# EAGLE design Loetstation (EAGLE 9.2.2)
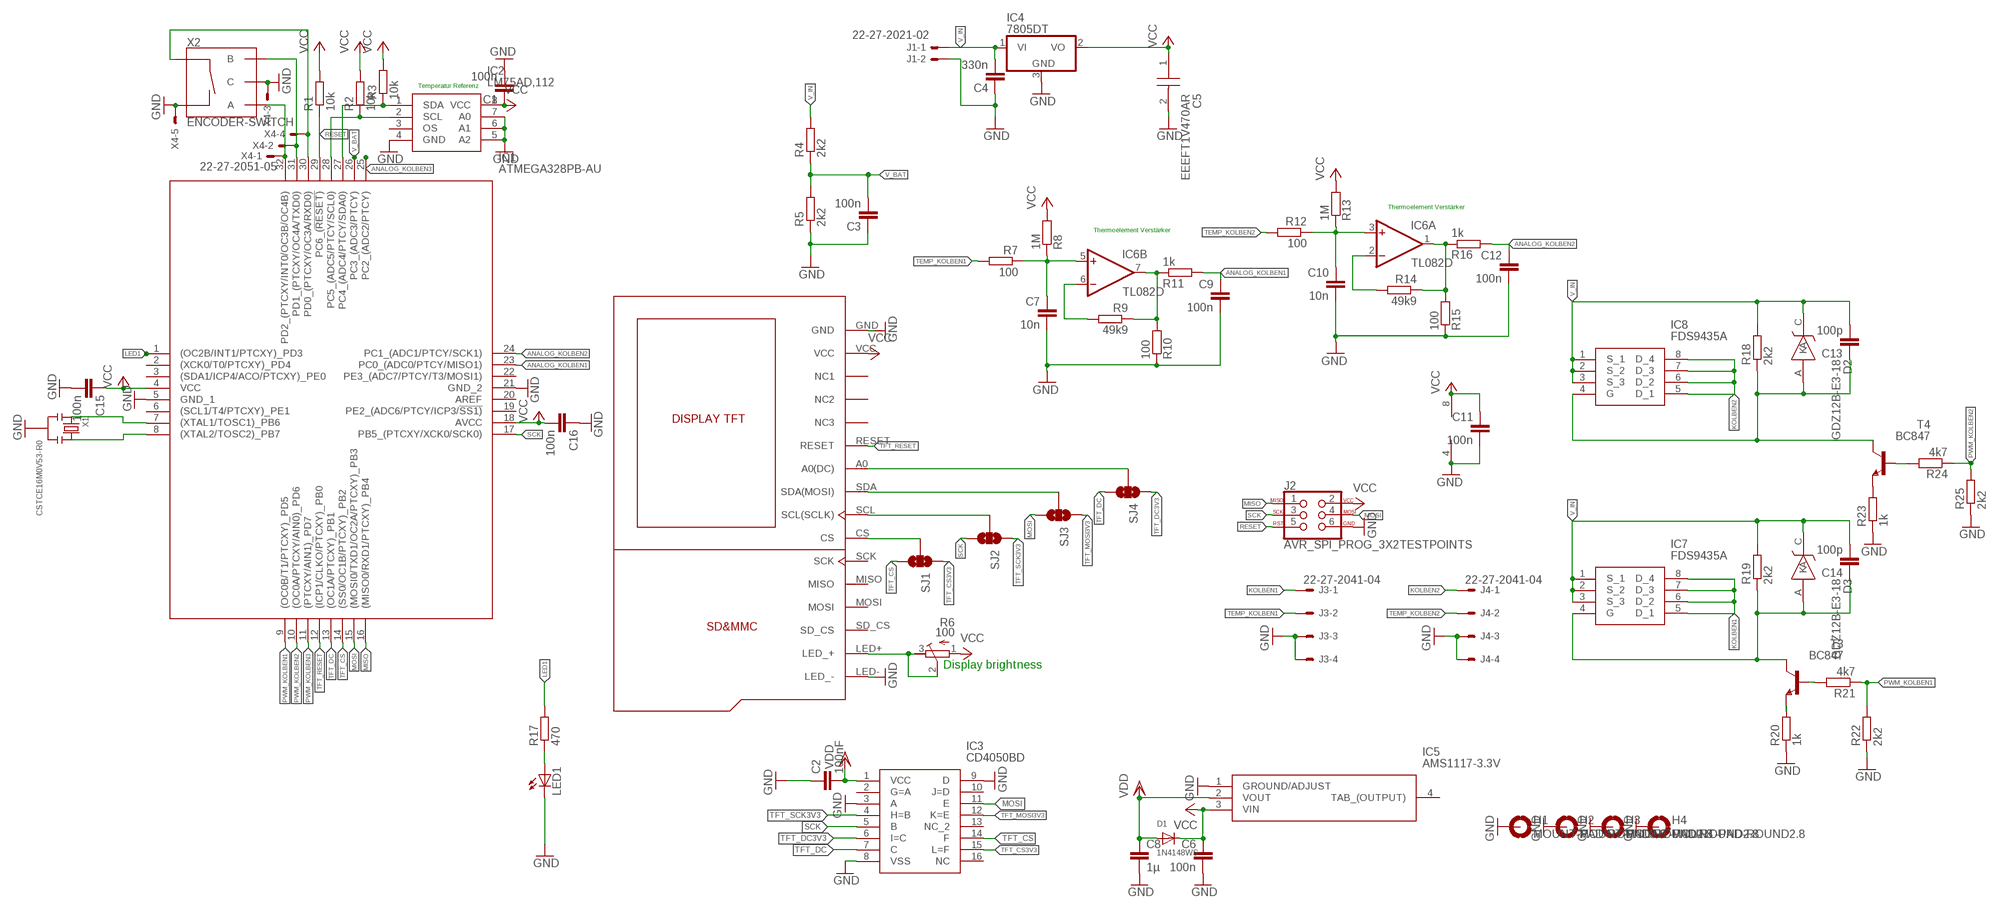
[diagram p0: schematic, sheet 1]

## Parts
C1  100n  C-EUC0603  [C0603]
C2  100nF  C-EUC0603  [C0603]
C3  100n  C-EUC0603  [C0603]
C4  330n  C-EUC0603  [C0603]
C5  EEEFT1V470AR  [EEEFT(C)]
C6  100n  C-EUC0603  [C0603]
C7  10n  C-EUC0603  [C0603]
C8  1µ  C-EUC0603  [C0603]
C9  100n  C-EUC0603  [C0603]
C10  10n  C-EUC0603  [C0603]
C11  100n  C-EUC0603  [C0603]
C12  100n  C-EUC0603  [C0603]
C13  100p  C-EUC0603  [C0603]
C14  100p  C-EUC0603  [C0603]
C15  100n  C-EUC0603  [C0603]
C16  100n  C-EUC0603  [C0603]
D1  1N4148WS  DIODESOD-323F  [SOD-323F]
D2  GDZ12B-E3-18  [SOD323-W]
D3  GDZ12B-E3-18  [SOD323-W]
H1  MOUNT-PAD-ROUND2.8  [2,8-PAD]
H2  MOUNT-PAD-ROUND2.8  [2,8-PAD]
H3  MOUNT-PAD-ROUND2.8  [2,8-PAD]
H4  MOUNT-PAD-ROUND2.8  [2,8-PAD]
IC1  ATMEGA328PB-AU  [QFP80P900X900X120-32N]
IC2  LM75AD,112  [SOIC127P600X175-8N]
IC3  CD4050BD  [SOIC127P600X175-16N]
IC4  7805DT  [TO252]
IC5  AMS1117-3.3V  [SOT229P700X180-4N]
IC6  TL082D  [SO08]
IC7  FDS9435A  [SOIC127P600X175-8N]
IC8  FDS9435A  [SOIC127P600X175-8N]
J1  22-27-2021-02  [6410-02]
J2  AVR_SPI_PROG_3X2TESTPOINTS  [2X3_TEST_POINTS]
J3  22-27-2041-04  [6410-04]
J4  22-27-2041-04  [6410-04]
LED1  LEDCHIPLED_0805  [CHIPLED_0805]
R1  10k  R-EU_R0402  [R0402]
R2  10k  R-EU_R0402  [R0402]
R3  10k  R-EU_R0402  [R0402]
R4  2k2  R-EU_R0402  [R0402]
R5  2k2  R-EU_R0402  [R0402]
R6  100  EVM-3ESX50B  [EVM-3ESX50B]
R7  100  R-EU_R0402  [R0402]
R8  1M  R-EU_R0402  [R0402]
R9  49k9  R-EU_R0402  [R0402]
R10  100  R-EU_R0402  [R0402]
R11  1k  R-EU_R0402  [R0402]
R12  100  R-EU_R0402  [R0402]
R13  1M  R-EU_R0402  [R0402]
R14  49k9  R-EU_R0402  [R0402]
R15  100  R-EU_R0402  [R0402]
R16  1k  R-EU_R0402  [R0402]
R17  470  R-EU_R0402  [R0402]
R18  2k2  R-EU_R0402  [R0402]
R19  2k2  R-EU_R0402  [R0402]
R20  1k  R-EU_R0402  [R0402]
R21  4k7  R-EU_R0402  [R0402]
R22  2k2  R-EU_R0402  [R0402]
R23  1k  R-EU_R0402  [R0402]
R24  4k7  R-EU_R0402  [R0402]
R25  2k2  R-EU_R0402  [R0402]
SJ1  SOLDERJUMPER_2WAYS  [SJ_3]
SJ2  SOLDERJUMPER_2WAYS  [SJ_3]
SJ3  SOLDERJUMPER_2WAYS  [SJ_3]
SJ4  SOLDERJUMPER_2WAYS  [SJ_3]
T3  BC847  [SOT23]
T4  BC847  [SOT23]
X1  CSTCE16M0V53-R0  [CSTCE-V]
X2  ENCODER-SWITCH  (no package)
X3  DISPLAY_TFT_1,8  [DISPLAY_TFT_1,8-KMR]
X4  22-27-2051-05  [6410-05]

## Nets
ANALOG_KOLBEN1: C9.1 IC1.23(PC0_(ADC0/PTCY/MISO1)) R11.2
ANALOG_KOLBEN2: C12.1 IC1.24(PC1_(ADC1/PTCY/SCK1)) R16.2
ANALOG_KOLBEN3: IC1.25(PC2_(ADC2/PTCY))
GND: C1.2 C2.1 C3.1 C4.1 C5.2(+) C6.2 C7.2 C8.2 C9.2 C10.2 C11.2 C12.2 C15.2 C16.1 H1.B2,8(MOUNT) H2.B2,8(MOUNT) H3.B2,8(MOUNT) H4.B2,8(MOUNT) IC1.5(GND_1) IC1.21(GND_2) IC2.4(GND) IC2.5(A2) IC2.6(A1) IC2.7(A0) IC3.3(A) IC3.8(VSS) IC3.9(D) IC4.3(GND) IC5.1(GROUND/ADJUST) IC6.4(P:V-) J1.2 J2.6 J3.3 J3.4 J4.3 J4.4 LED1.C R5.1 R10.1 R15.1 R20.1 R22.1 R23.1 R25.1 X1.2 X2.C X2.SW- X3.GND X3.LED-(LED_-) X4.3 X4.5
KOLBEN1: IC7.5(D_1) IC7.6(D_2) IC7.7(D_3) IC7.8(D_4) J3.1
KOLBEN2: IC8.5(D_1) IC8.6(D_2) IC8.7(D_3) IC8.8(D_4) J4.1
LED1: IC1.1((OC2B/INT1/PTCXY)_PD3) R17.2
MISO: IC1.16((MISO0/RXD1/PTCXY)_PB4) J2.1
MOSI: IC1.15((MOSI0/TXD1/OC2A/PTCXY)_PB3) IC3.11(E) J2.4 SJ3.3
N$1: SJ4.2 X3.A0(A0(DC))
N$2: SJ3.2 X3.SDA(SDA(MOSI))
N$4: C13.1 D2.A IC8.4(G) R18.1 T4.3(C)
N$5: C14.1 D3.A IC7.4(G) R19.1 T3.3(C)
N$6: R24.2 T4.1(B)
N$7: R23.2 T4.2(E)
N$8: IC6.7(B:OUT) R9.1 R10.2 R11.1
N$9: R21.2 T3.1(B)
N$10: R20.2 T3.2(E)
N$11: C7.1 IC6.5(B:+IN) R7.1 R8.1
N$12: IC1.7((XTAL1/TOSC1)_PB6) X1.1
N$13: IC1.8((XTAL2/TOSC2)_PB7) X1.3
N$14: IC1.28(PC5_(ADC5/PTCY/SCL0)) IC2.2(SCL) R2.1
N$15: IC1.27(PC4_(ADC4/PTCY/SDA0)) IC2.1(SDA) R3.1
N$16: SJ2.2 X3.SCL(SCL(SCLK))
N$17: SJ1.2 X3.CS
N$18: IC6.6(B:-IN) R9.2
N$19: C10.1 IC6.3(A:+IN) R12.1 R13.1
N$20: LED1.A R17.1
N$21: IC1.32(PD2_(PTCXY/INT0/OC3B/OC4B)) X2.A X4.1
N$22: IC1.31(PD1_(PTCXY/OC4A/TXD0)) X2.B X4.2
N$23: IC1.30(PD0_(PTCXY/OC3A/RXD0)) X2.SW+ X4.4
N$24: R6.2(S) R6.3(E) X3.LED+(LED_+)
N$25: IC6.1(A:OUT) R14.1 R15.2 R16.1
N$26: IC6.2(A:-IN) R14.2
PWM_KOLBEN1: IC1.9((OC0B/T1/PTCXY)_PD5) R21.1 R22.2
PWM_KOLBEN2: IC1.10((OC0A/PTCXY/AIN0)_PD6) R24.1 R25.2
PWM_KOLBEN3: IC1.11((PTCXY/AIN1)_PD7)
RESET: IC1.29(PC6_(!RESET)) J2.5 R1.1
SCK: IC1.17(PB5_(PTCXY/XCK0/SCK0)) IC3.5(B) J2.3 SJ2.3
TEMP_KOLBEN1: J3.2 R7.2
TEMP_KOLBEN2: J4.2 R12.2
TFT_CS: IC1.14((SS0/OC1B/PTCXY)_PB2) IC3.14(F) SJ1.3
TFT_CS3V3: IC3.15(L=F) SJ1.1
TFT_DC: IC1.13((OC1A/PTCXY)_PB1) IC3.7(C) SJ4.3
TFT_DC3V3: IC3.6(I=C) SJ4.1
TFT_MOSI3V3: IC3.12(K=E) SJ3.1
TFT_RESET: IC1.12((ICP1/CLKO/PTCXY)_PB0) X3.RESET
TFT_SCK3V3: IC3.4(H=B) SJ2.1
V_BAT: C3.2 IC1.26(PC3_(ADC3/PTCY)) R4.1 R5.2
V_IN: C4.2 C13.2 C14.2 D2.C(K) D3.C(K) IC4.1(VI) IC7.1(S_1) IC7.2(S_2) IC7.3(S_3) IC8.1(S_1) IC8.2(S_2) IC8.3(S_3) J1.1 R4.2 R18.2 R19.2
VCC: C1.1 C5.1(-) C6.1 C11.1 C15.1 C16.2 D1.C IC1.4(VCC) IC1.18(AVCC) IC2.8(VCC) IC4.2(VO) IC5.3(VIN) IC6.8(P:V+) J2.2 R1.2 R2.2 R3.2 R6.1(A) R8.2 R13.2 X3.VCC
VDD: C2.2 C8.1 D1.A IC3.1(VCC) IC5.2(VOUT)
Unconnected: IC1.2((XCK0/T0/PTCXY)_PD4) IC1.3((SDA1/ICP4/ACO/PTCXY)_PE0) IC1.6((SCL1/T4/PTCXY)_PE1) IC1.19(PE2_(ADC6/PTCY/ICP3/!SS1)) IC1.20(AREF) IC1.22(PE3_(ADC7/PTCY/T3/MOSI1)) IC2.3(OS) IC3.2(G=A) IC3.10(J=D) IC3.13(NC_2) IC3.16(NC) IC5.4(TAB_(OUTPUT)) X3.MISO X3.MOSI X3.NC1 X3.NC2 X3.NC3 X3.SCK X3.SD_CS

## Notes on the sheet
- Temperatur Referenz
- Thermoelement Verstärker
- Thermoelement Verstärker
- Display brightness

## Library data of the parts
C1-C4 C6-C16 = resistor:C-EU: CAPACITOR, European symbol
C5 = SamacSys_Parts:EEEFT1V470AR: FT SMT Al elec capacitor 47uF 35V Panasonic 47F 35 V dc Aluminium Electrolytic Capacitor C, FT SMD Series 2000h 5 Dia. x 5.8mm Source: Datasheet <http://uk.rs-online.com/web/p/products/1034782>; ALLIED_NUMBER: 70256704; ALLIED_PRICE/STOCK: https://www.alliedelec.com/panasonic-eee-ft1v470ar/70256704/; ARROW_PART_NUMBER: EEEFT1V470AR; ARROW_PRICE/STOCK: https://www.arrow.com/en/products/eeeft1v470ar/panasonic; DESCRIPTION: FT SMT Al elec capacitor 47uF 35V Panasonic 47F 35 V dc Aluminium Electrolytic Capacitor C, FT SMD Series 2000h 5 Dia. x 5.8mm; HEIGHT: mm; MANUFACTURER_NAME: Panasonic; MANUFACTURER_PART_NUMBER: EEEFT1V470AR; RS_PART_NUMBER: 7296261P; RS_PRICE/STOCK: http://uk.rs-online.com/web/p/products/7296261P
D1 = adafruit:DIODE: Diode SMADIODE - SMA Surface Mount Package 20V 1A Schottky Diode Digikey: 641-1014-6-ND DO-1N4148 - Through Hole Small Current Diode SOD-123 20V 1 A (.5mV Vf) Schottky Diode - Digikey: MBRX120TPMSCT-ND SOD-323 10V 570mA (.38mV Vf, 3ns) Schottky Diode - Digikey: ZLLS410CT-ND SOD-523 30V 30mA Schottky Diode (RB751S-40TE61) - Digikey: RB751S-40TE61CT-ND SOT23-R/W - SOT23 Package (R = Solder Paste/Reflow Ovens, W = Hand-Soldering) BAT54Film 40V 300mA - Digikey: 497-7162-1-ND
D2 D3 = user:GDZ12B-E3-18: Zener Diodes 12 Volt 0.2 Watt 2% Source: Datasheet <https://componentsearchengine.com/Datasheets/1/GDZ12B-E3-18.pdf>; SPICEPREFIX: D
H1-H4 = holes:MOUNT-PAD-ROUND: MOUNTING PAD, round
IC1 = SamacSys_Parts:ATMEGA328PB-AU: ATMEL - ATMEGA328PB-AU - MCU, 8BIT, ATMEGA, 20MHZ, TQFP-32 Source: Datasheet <http://www.farnell.com/datasheets/2014286.pdf>; ARROW_PART_NUMBER: ATMEGA328PB-AU; ARROW_PRICE/STOCK: https://www.arrow.com/en/products/atmega328pb-au/microchip-technology; DESCRIPTION: ATMEL - ATMEGA328PB-AU - MCU, 8BIT, ATMEGA, 20MHZ, TQFP-32; HEIGHT: 1.2mm; MANUFACTURER_NAME: Microchip; MANUFACTURER_PART_NUMBER: ATMEGA328PB-AU; RS_PART_NUMBER: 1463221; RS_PRICE/STOCK: http://uk.rs-online.com/web/p/products/1463221
IC2 = SamacSys_Parts:LM75AD,112: LM75AD,112, 11bit Temperature Sensor 3C Serial-I2C 2.8 to 5.5V 8-Pin SOIC Source: Datasheet <http://docs-europe.electrocomponents.com/webdocs/0b4c/0900766b80b4c8ed.pdf>; ARROW_PART_NUMBER: LM75AD,112; ARROW_PRICE-STOCK: https://www.arrow.com/en/products/lm75ad112/nxp-semiconductors; DESCRIPTION: LM75AD,112, 11bit Temperature Sensor 3C Serial-I2C 2.8 to 5.5V 8-Pin SOIC; HEIGHT: 1.75mm; MANUFACTURER_NAME: Nexperia; MANUFACTURER_PART_NUMBER: LM75AD,112; RS_PART_NUMBER: 1242317; RS_PRICE-STOCK: http://uk.rs-online.com/web/p/products/1242317
IC3 = SamacSys_Parts:CD4050BD: CMOS Hex Non-Inverting Buffer/Converter Source: Datasheet <http://www.ti.com/lit/gpn/cd4050b>; ARROW_PART_NUMBER: CD4050BD; ARROW_PRICE-STOCK: https://www.arrow.com/en/products/cd4050bd/texas-instruments; DESCRIPTION: CMOS Hex Non-Inverting Buffer/Converter; HEIGHT: mm; MANUFACTURER_NAME: Texas Instruments; MANUFACTURER_PART_NUMBER: CD4050BD; RS_PART_NUMBER: 8072365; RS_PRICE-STOCK: http://uk.rs-online.com/web/p/products/8072365
IC4 = linear:78*: Positive VOLTAGE REGULATOR Source: http://cache.national.com/ds/LM/LM78L05.pdf http://www.fairchildsemi.com/ds/LM/LM7805.pdf
IC5 = SamacSys_Parts:AMS1117-3.3V: 1A LOW DROPOUT VOLTAGE REGULATOR, SOT-223 Source: Datasheet <http://www.advanced-monolithic.com/pdf/ds1117.pdf>; ARROW_PART_NUMBER: ams1117-3.3v; DESCRIPTION: 1A LOW DROPOUT VOLTAGE REGULATOR, SOT-223; HEIGHT: 1.8mm; MANUFACTURER_NAME: Advanced Monolithic Systems; MANUFACTURER_PART_NUMBER: ams1117-3.3v
IC6 = linear:TL082: OP AMP Data sheet <http://www.ti.com/lit/ds/symlink/tl084a . pdf>; DATA_SHEET: <a href="http://www.ti.com/lit/ds/symlink/tl084a.pdf"> Data sheet </a>; SPICEPREFIX: J
IC7 IC8 = SamacSys_Parts:FDS9435A: FDS9435A, P-channel MOSFET Transistor 5.3 A 30 V, 8-Pin SOIC Source: Datasheet <http://docs-emea.rs-online.com/webdocs/0d23/0900766b80d237a1.pdf>; DESCRIPTION: FDS9435A, P-channel MOSFET Transistor 5.3 A 30 V, 8-Pin SOIC; HEIGHT: 1.75mm; MANUFACTURER_NAME: Fairchild Semiconductor; MANUFACTURER_PART_NUMBER: FDS9435A; MOUSER_PART_NUMBER: 512-FDS9435A; MOUSER_PRICE-STOCK: https://www.mouser.com/Search/Refine.aspx?Keyword=512-FDS9435A; RS_PART_NUMBER: 6710750P; RS_PRICE-STOCK: http://uk.rs-online.com/web/p/products/6710750P
J1 = con-molex:22-?-02: CONNECTOR wire to board 2.54 mm (.1 inch) pitch header; MF: MOLEX; OC_FARNELL: unknown; OC_NEWARK: unknown
J2 = SparkFun-Connectors:AVR_SPI_PROG_3X2: AVR ISP 6 Pin This is the reduced ISP connector for AVR programming. Common on Arduino. This footprint will take up less PCB space and can be used with a 10-pin to 6-pin adapter such as SKU: BOB-08508 **Special note about "TEST_POINT" package. The stop mask is on the top side, so if you want your programming test points to be on the bottom of your board, make sure to place this package on the bottom side of the board. This also ensure that the orientation to program from the bottom side will be correct. SparkFun Products: SparkFun ISP Pogo Adapter <https://www.sparkfun.com/products/11591> - NS Tiny AVR Programmer <https://www.sparkfun.com/products/11801> -PTH
J3 J4 = con-molex:22-?-04: CONNECTOR wire to board 2.54 mm (.1 inch) pitch header; MF: MOLEX; OC_FARNELL: unknown; OC_NEWARK: unknown
LED1 = led:LED: LED OSRAM: - CHIPLED LG R971, LG N971, LY N971, LG Q971, LY Q971, LO R971, LY R971 LH N974, LH R974 LS Q976, LO Q976, LY Q976 LO Q996 - Hyper CHIPLED LW Q18S LB Q993, LB Q99A, LB R99A - SideLED LS A670, LO A670, LY A670, LG A670, LP A670 LB A673, LV A673, LT A673, LW A673 LH A674 LY A675 LS A676, LA A676, LO A676, LY A676, LW A676 LS A679, LY A679, LG A679 - Hyper Micro SIDELED® LS Y876, LA Y876, LO Y876, LY Y876 LT Y87S - SmartLED LW L88C, LW L88S LB L89C, LB L89S, LG L890 LS L89K, LO L89K, LY L89K LS L896, LA L896, LO L896, LY L896 - TOPLED LS T670, LO T670, LY T670, LG T670, LP T670 LSG T670, LSP T670, LSY T670, LOP T670, LYG T670 LG T671, LOG T671, LSG T671 LB T673, LV T673, LT T673, LW T673 LH T674 LS T676, LA T676, LO T676, LY T676, LB T676, LH T676, LSB T676, LW T676 LB T67C, LV T67C, LT T67C, LS T67K, LO T67K, LY T67K, LW E67C LS E67B, LA E67B, LO E67B, LY E67B, LB E67C, LV E67C, LT E67C LW T67C LS T679, LY T679, LG T679 LS T770, LO T770, LY T770, LG T770, LP T770 LB T773, LV T773, LT T773, LW T773 LH T774 LS E675, LA E675, LY E675, LS T675 LS T776, LA T776, LO T776, LY T776, LB T776 LHGB T686 LT T68C, LB T68C - Hyper Mini TOPLED® LB M676 - Mini TOPLED Santana® LG M470 LS M47K, LO M47K, LY M47K Source: http://www.osram.convergy.de LUXEON: - LUMILED® LXK2-PW12-R00, LXK2-PW12-S00, LXK2-PW14-U00, LXK2-PW14-V00 LXK2-PM12-R00, LXK2-PM12-S00, LXK2-PM14-U00 LXK2-PE12-Q00, LXK2-PE12-R00, LXK2-PE12-S00, LXK2-PE14-T00, LXK2-PE14-U00 LXK2-PB12-K00, LXK2-PB12-L00, LXK2-PB12-M00, LXK2-PB14-N00, LXK2-PB14-P00, LXK2-PB14-Q00 LXK2-PR12-L00, LXK2-PR12-M00, LXK2-PR14-Q00, LXK2-PR14-R00 LXK2-PD12-Q00, LXK2-PD12-R00, LXK2-PD12-S00 LXK2-PH12-R00, LXK2-PH12-S00 LXK2-PL12-P00, LXK2-PL12-Q00, LXK2-PL12-R00 Source: www.luxeon.com KINGBRIGHT: KA-3528ASYC Source: www.kingbright.com
R1-R5 R7-R25 = resistor:R-EU_: RESISTOR, European symbol
R6 = user:EVM-3ESX50B
SJ1-SJ4 = SparkFun-Retired:SOLDERJUMPER_2WAY: Solder Jumper 2 way solder jumper
T3 T4 = transistor:BC847: NPN TRANSISTOR
X1 = user:CSTCE16M0V53-R0: Ceramic resonator SMT CSTCE 16.00MHz CSTCE16M0V53-R0, Ceramic Resonator, 16MHz Expander 15pF, 3-Pin Cap Chip, 3.2 x 1.3 x 0.9mm Source: Datasheet <http://uk.rs-online.com/web/p/products/6241077>; ARROW_PART_NUMBER: CSTCE16M0V53-R0; ARROW_PRICE-STOCK: https://www.arrow.com/en/products/cstce16m0v53-r0/murata-manufacturing; DESCRIPTION: Ceramic resonator SMT CSTCE 16.00MHz CSTCE16M0V53-R0, Ceramic Resonator, 16MHz Expander 15pF, 3-Pin Cap Chip, 3.2 x 1.3 x 0.9mm; HEIGHT: mm; MANUFACTURER_NAME: Murata Electronics; MANUFACTURER_PART_NUMBER: CSTCE16M0V53-R0; RS_PART_NUMBER: 7926524P; RS_PRICE-STOCK: http://uk.rs-online.com/web/p/products/7926524P
X2 = Symbols-Not-On-Board:ENCODER-SWITCH
X3 = display-TFT-1.8-KMR:DISPLAY_TFT_1,8
X4 = con-molex:22-?-05: CONNECTOR wire to board 2.54 mm (.1 inch) pitch header; MF: MOLEX; OC_FARNELL: unknown; OC_NEWARK: unknown

## Net classes
0 default: width 0.089 mm, drill 0.3 mm

## Board
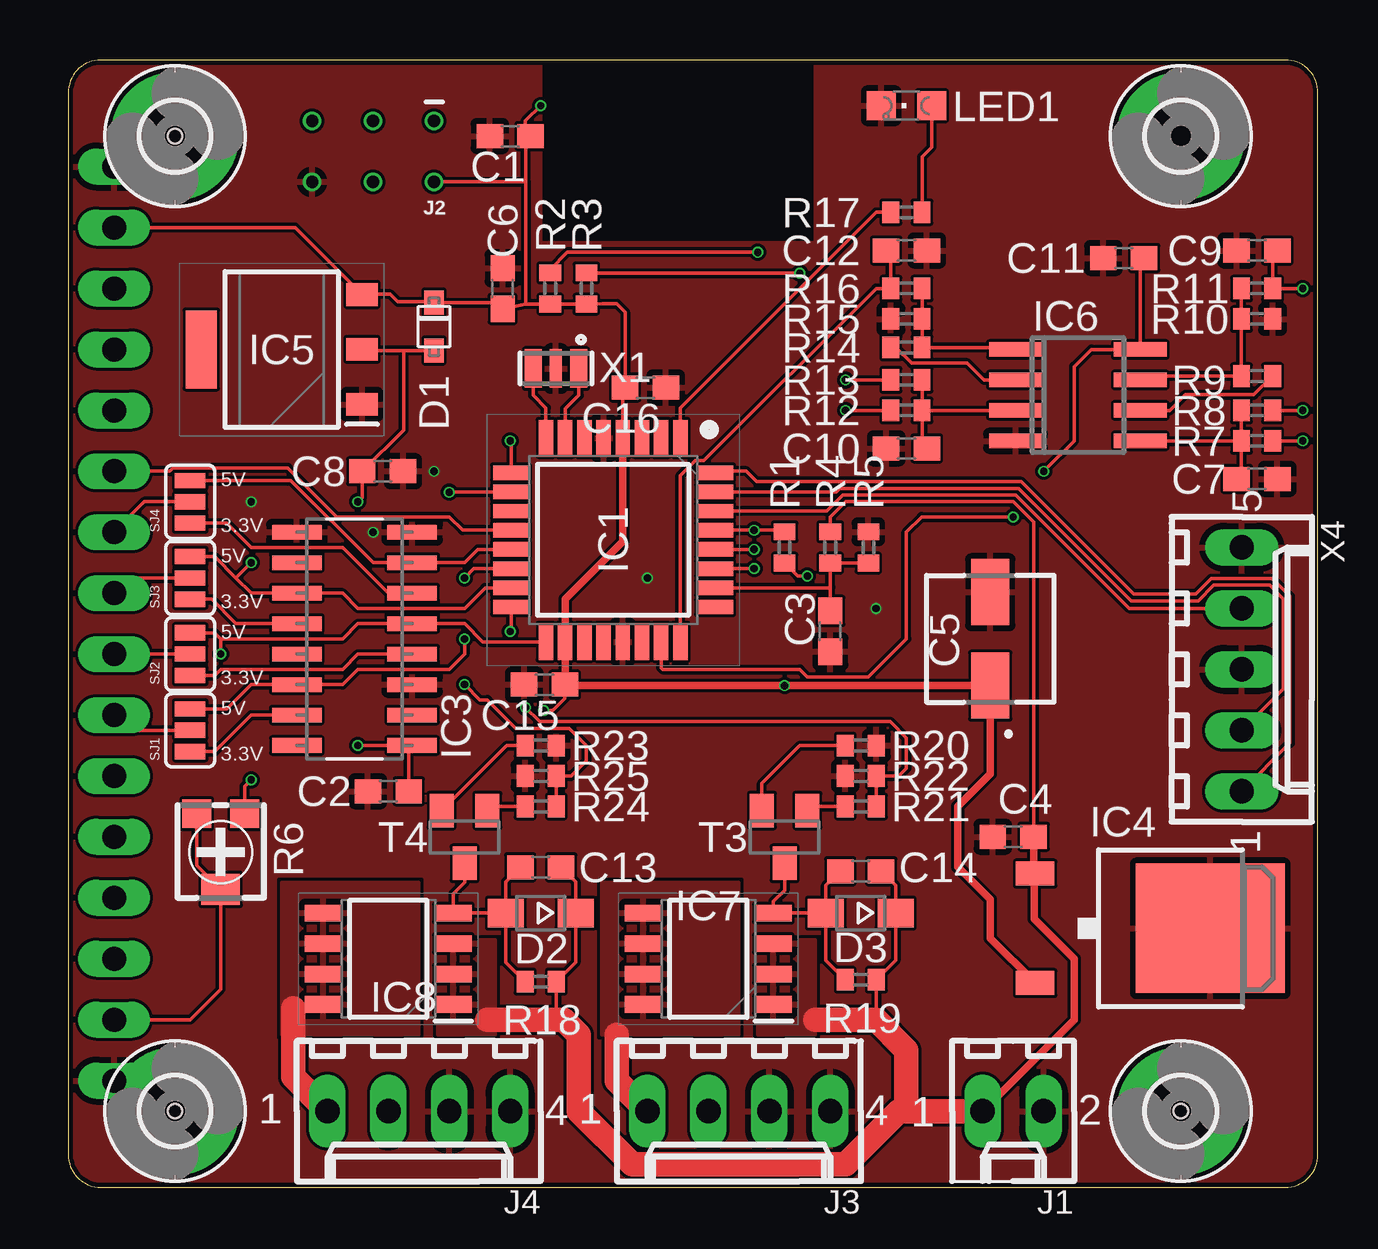
[diagram p1: board, top side]
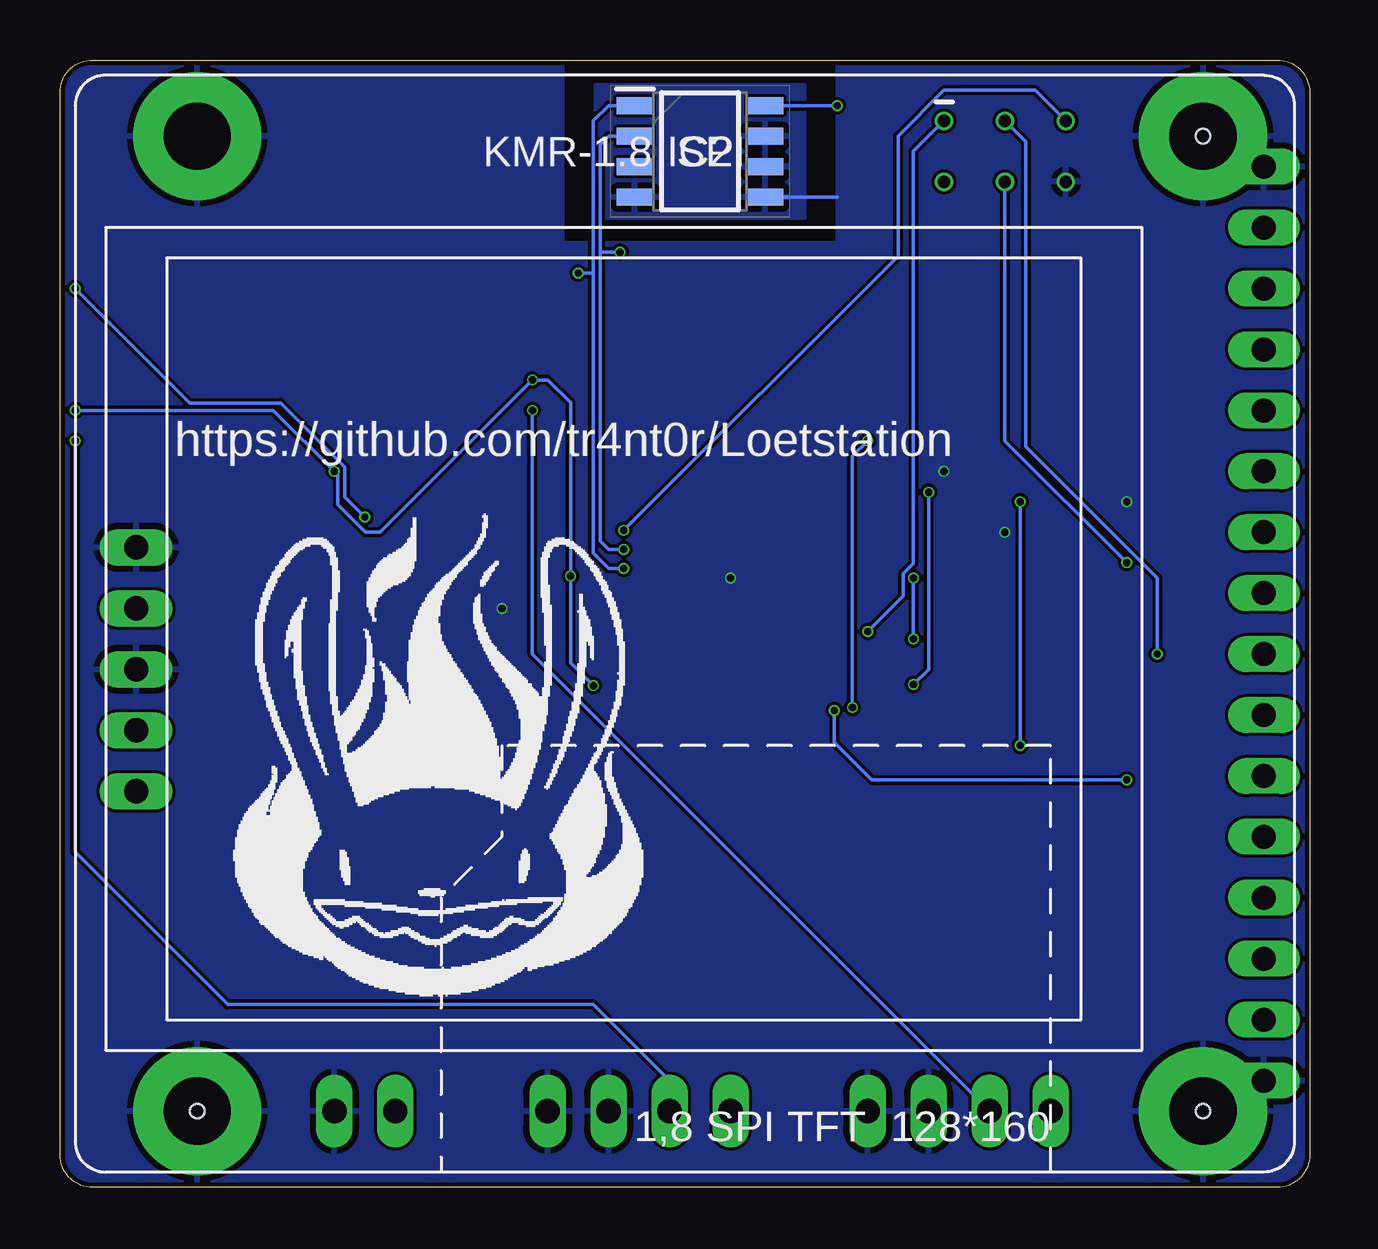
[diagram p2: board, bottom side, seen from below]

Size 52.07 x 46.99 mm. Coordinates in mm from the lower left corner, seen from the top.
Outline: 1.34,0 50.72,0 arc90 52.07,1.35 52.07,45.63 arc90 50.72,46.99 1.35,46.99 arc90 0,45.63 0,1.34 arc90 1.34,0
Copper layers (1*16): Top 0.035mm / dielectric 1.5mm / Bottom 0.035mm
Design rules "jlcpcb *": minimum track width 3.5mil, minimum drill 0.3mm, track to track 5mil, track to pad 5mil, pad to pad 6mil, via to via 6mil, smd to smd 6mil, copper to edge 0.2mm, drill to drill 0.3mm, minimum pad ring 3mil, minimum via ring 3mil, stop-mask expansion 4mil, vias tented up to drill 0mil, thermal gap 10mil

### Footprints (pad centres in the part's own frame; a part is rotated, then mirrored left to right if it is on the bottom)
C0603 = smd 1.1 x 1: 1 -0.85,0; 2 0.85,0
EEEFT(C) = smd 2.75 x 1.6: 1 -1.95,0; 2 1.95,0
SOD-323F = smd 1 x 0.8: A -1,0; C 1,0
SOD323-W = smd 1.5 x 1.2: A 1.45,0; C -1.45,0
2,8-PAD = drill 2.8 pad 5.334: B2,8 0,0
QFP80P900X900X120-32N = smd 1.5 x 0.6: 1 -4.25,2.8; 2 -4.25,2; 3 -4.25,1.2; 4 -4.25,0.4; 5 -4.25,-0.4; 6 -4.25,-1.2; 7 -4.25,-2; 8 -4.25,-2.8; 17 4.25,-2.8; 18 4.25,-2; 19 4.25,-1.2; 20 4.25,-0.4; 21 4.25,0.4; 22 4.25,1.2; 23 4.25,2; 24 4.25,2.8 | smd 0.6 x 1.5: 9 -2.8,-4.25; 10 -2,-4.25; 11 -1.2,-4.25; 12 -0.4,-4.25; 13 0.4,-4.25; 14 1.2,-4.25; 15 2,-4.25; 16 2.8,-4.25; 25 2.8,4.25; 26 2,4.25; 27 1.2,4.25; 28 0.4,4.25; 29 -0.4,4.25; 30 -1.2,4.25; 31 -2,4.25; 32 -2.8,4.25
SOIC127P600X175-8N = smd 1.525 x 0.7: 1 -2.712,1.905; 2 -2.712,0.635; 3 -2.712,-0.635; 4 -2.712,-1.905; 5 2.712,-1.905; 6 2.712,-0.635; 7 2.712,0.635; 8 2.712,1.905
SOIC127P600X175-16N = smd 2.057 x 0.61: 1 -4.801,8.89; 2 -4.801,7.62; 3 -4.801,6.35; 4 -4.801,5.08; 5 -4.801,3.81; 6 -4.801,2.54; 7 -4.801,1.27; 8 -4.801,0; 9 0,0; 10 0,1.27; 11 0,2.54; 12 0,3.81; 13 0,5.08; 14 0,6.35; 15 0,7.62; 16 0,8.89
TO252 = smd 1 x 1.6: 1 -2.28,-4.8; 2 2.28,-4.8 | smd 5.4 x 6.2: 3 0,2.5
SOT229P700X180-4N = smd 1.3 x 0.95: 1 -3.35,2.29; 2 -3.35,0; 3 -3.35,-2.29 | smd 1.3 x 3.25: 4 3.35,0
SO08 = smd 0.6 x 2.2: 1 -1.905,-2.6; 2 -0.635,-2.6; 3 0.635,-2.6; 4 1.905,-2.6; 5 1.905,2.6; 6 0.635,2.6; 7 -0.635,2.6; 8 -1.905,2.6
6410-02 = drill 1.016 long: 1 1.27,0; 2 -1.27,0
2X3_TEST_POINTS = drill 0.508: 1 -2.54,-1.27; 2 -2.54,1.27; 3 0,-1.27; 4 0,1.27; 5 2.54,-1.27; 6 2.54,1.27
6410-04 = drill 1.016 long: 1 3.81,0; 2 1.27,0; 3 -1.27,0; 4 -3.81,0
CHIPLED_0805 = smd 1.2 x 1.2: A 0,-1.05; C 0,1.05
R0402 = smd 0.7 x 0.9: 1 -0.65,0; 2 0.65,0
EVM-3ESX50B = smd 1.2 x 1.2: 1 -1,-1.6; 3 1,-1.6 | smd 1.6 x 1.3: 2 0,1.55
SJ_3 = smd 0.635 x 1.27: 1 -0.889,0; 2 0,0; 3 0.889,0
SOT23 = smd 1 x 1.4: 1 -0.95,-1.1; 2 0.95,-1.1; 3 0,1.1
CSTCE-V = smd 0.7 x 1.6: 1 0.95,0; 3 -0.95,0 | smd 0.5 x 1.6: 2 0,0
DISPLAY_TFT_1,8-KMR = drill 1 long: A0 -25.4,-3.81; CS -25.4,3.81; GND -25.4,-19.05; LED+ -25.4,16.51; LED- -25.4,19.05; MISO -25.4,8.89; MOSI -25.4,11.43; NC1 -25.4,-13.97; NC2 -25.4,-11.43; NC3 -25.4,-8.89; RESET -25.4,-6.35; SCK -25.4,6.35; SCL -25.4,1.27; SD_CS -25.4,13.97; SDA -25.4,-1.27; VCC -25.4,-16.51 | hole 0.6: -22.86,-20.32; -22.86,20.32; 19.05,20.32
6410-05 = drill 1.016 long: 1 5.08,0; 2 2.54,0; 3 0,0; 4 -2.54,0; 5 -5.08,0

### Placement (x,y rotation side)
C1  18.41,43.81 180 top
C2  13.34,16.51 0 top
C3  31.75,23.18 90 top
C4  39.37,14.61 0 top
C5  38.42,22.86 90 top
C6  18.1,37.47 90 top
C7  49.53,29.53 0 top
C8  13.1,29.84 0 top
C9  49.53,39.05 180 top
C10  34.92,30.8 180 top
C11  43.97,38.73 180 top
C12  34.92,39.05 0 top
C13  19.68,13.34 0 top
C14  33.02,13.18 0 top
C15  19.84,20.95 180 top
C16  24.05,33.34 180 top
D1  15.24,35.88 90 top
D2  19.68,11.43 180 top
D3  33.02,11.43 180 top
H1  46.35,3.17 0 top
H2  4.45,3.17 0 top
H3  4.45,43.81 0 top
H4  46.35,43.81 0 top
IC1  22.7,26.99 270 top
IC2  25.4,43.18 0 bottom
IC3  9.53,27.3 180 top
IC4  45.09,10.79 270 top
IC5  8.89,34.92 180 top
IC6  42.07,33.02 270 top
IC7  26.67,9.53 180 top
IC8  13.34,9.53 180 top
J1  39.37,3.17 180 top
J2  12.7,43.18 180 top
J3  27.94,3.17 180 top
J4  14.61,3.17 180 top
LED1  34.92,45.09 90 top
R1  29.84,26.67 270 top
R2  20.08,37.47 270 top
R3  21.59,37.47 270 top
R4  31.75,26.67 90 top
R5  33.34,26.67 270 top
R6  6.35,13.97 180 top
R7  49.53,31.11 0 top
R8  49.53,32.38 0 top
R9  49.53,33.81 0 top
R10  49.53,36.2 180 top
R11  49.53,37.47 0 top
R12  34.92,32.38 180 top
R13  34.92,33.66 180 top
R14  34.92,35 180 top
R15  34.92,36.2 0 top
R16  34.92,37.47 180 top
R17  34.92,40.64 180 top
R18  19.68,8.57 0 top
R19  33.02,8.65 0 top
R20  33.02,18.41 180 top
R21  33.02,15.88 180 top
R22  33.02,17.14 0 top
R23  19.68,18.41 180 top
R24  19.68,15.88 180 top
R25  19.68,17.14 0 top
SJ1  5.08,19.05 90 top
SJ2  5.08,22.23 90 top
SJ3  5.08,25.4 90 top
SJ4  5.08,28.57 90 top
T3  29.84,14.61 180 top
T4  16.51,14.61 180 top
X1  20.32,34.13 0 top
X3  27.3,23.5 180 bottom
X4  48.9,21.59 270 top

### Tracks (layer width: path | path; a pad name or v marks a point on that pad's centre or on a via)
ANALOG_KOLBEN1  (via drill 0.3)
  Top 0.152: IC1.23 24.7,21.65 24.77,21.59 30.48,21.59 30.8,21.27 33.34,21.27 34.92,22.86 34.92,27.3 35.56,27.94 v39.37,27.94 | v51.44,37.47 R11.2 50.18,38.53 C9.1
  Bottom 0.152: v39.37,27.94 40.21,28.78 40.21,30.02 42.88,32.69 46.66,32.69 v51.44,37.47
ANALOG_KOLBEN2
  Top 0.152: IC1.24 25.5,29.68 26.12,30.29 26.48,30.29 33.66,37.47 R16.2 34.27,38.53 C12.1
GND  (via drill 0.3)
  Bottom 0.152: IC2.5 19.68,41.27
  other vias: 24.13,25.4 12.7,27.3 7.62,28.57 15.24,29.84 33.66,24.13
  pour Bottom: 21.03,45.96 21.03,40.4 29.77,40.4 29.77,45.96
  pour Bottom (rank 2): 19.68,46.99 1.34,46.99 arc90 0,45.65 0,1.36 arc90 1.36,0 50.71,0 arc90 52.07,1.36 52.07,45.63 arc90 50.71,46.99 31.11,46.99 31.11,39.37 19.68,39.37
  pour Bottom (no thermals): 40.64,10.16 46.99,10.16 46.99,17.14 40.64,17.14
  pour Top (rank 2): 1.36,0 50.73,0 arc90 52.07,1.34 52.07,45.63 arc90 50.71,46.99 31.11,46.99 31.11,39.37 19.68,39.37 19.68,46.92 19.76,46.99 1.34,46.99 arc90 0,45.65 0,1.36 arc90
KOLBEN1
  Top 1.016: J3.1 22.86,4.45 22.86,6.35
  pour Top: 27.94,6.35 22.23,6.35 22.23,12.7 27.94,12.7
KOLBEN2
  Top 1.016: J4.1 9.37,4.6 9.37,7.46
  pour Top: 14.61,6.35 8.89,6.35 8.89,12.7 14.61,12.7
LED1
  Top 0.152: IC1.1 25.5,32.49 33.66,40.64 R17.2
MISO  (via drill 0.3)
  Top 0.152: v18.41,23.17 18.45,23.2 IC1.16
  Bottom 0.152: J2.1 16.51,43.18 16.51,26.01 16.94,25.58 16.94,24.64 v18.41,23.17
MOSI  (via drill 0.3)
  Top 0.152: SJ3.3 6.1,26.29 6.99,25.4 | 6.99,25.4 7.62,24.77 IC3.11 11.43,24.77 12.06,24.13 16.51,24.13 17.37,24.99 IC1.15 | v7.62,26.04 6.99,25.4
  Bottom 0.152: J2.4 12.7,31.11 v7.62,26.04
N$1
  Top 0.152: SJ4.2 3.17,28.57 X3.A0
N$2
  Top 0.152: X3.SDA 2.54,25.4 SJ3.2
N$4
  Top 0.152: T4.3 16.51,12.7 16.05,12.24 IC8.4 D2.A | D2.A 18.23,9.37 R18.1 | C13.1 18.23,12.73 D2.A
N$5
  Top 0.152: D3.A 31.57,12.58 C14.1 | D3.A 31.57,9.45 R19.1 | T3.3 29.84,12.38 29.38,11.92 IC7.4 D3.A
N$6
  Top 0.152: T4.1 17.63,15.88 R24.2
N$7
  Top 0.152: T4.2 18.27,18.41 R23.2
N$8
  Top 0.152: R10.2 48.9,36.2 R10.2 | R10.2 R9.1 44.83,33.81 IC6.7 | R10.2 R11.1
N$9
  Top 0.152: T3.1 30.96,15.88 R21.2
N$10
  Top 0.152: T3.2 28.89,16.83 30.48,18.41 R20.2
N$11
  Top 0.152: IC6.5 R7.1 | R7.1 R8.1 | R7.1 48.88,30.05 C7.1
N$12
  Top 0.152: IC1.7 20.7,32.45 21.27,33.02 X1.1
N$13
  Top 0.152: IC1.8 19.9,32.49 19.37,33.02 X1.3
N$14  (via drill 0.3)
  Top 0.152: v28.57,26.59 IC1.28 | R2.1 20.08,38.26 20.8,38.97 v28.73,38.97
  Bottom 0.152: 29.57,38.97 29.57,26.95 29.21,26.59 v28.57,26.59 | 29.57,38.97 29.57,43.46 29.21,43.81 IC2.2 | v28.73,38.97 29.57,38.97
N$15  (via drill 0.3)
  Top 0.152: v28.57,25.8 IC1.27 | R3.1 30.31,38.12 30.32,38.1 v30.48,38.1
  Bottom 0.152: 29.84,38.1 29.84,27.3 29.84,26.43 29.21,25.8 v28.57,25.8 | 29.84,38.1 29.84,44.45 29.21,45.09 IC2.1 | v30.48,38.1 29.84,38.1
N$16
  Top 0.152: SJ2.2 X3.SCL
N$17
  Top 0.152: SJ1.2 2.54,19.05 X3.CS
N$18
  Top 0.152: IC6.6 45.89,32.38 46.54,33.04 49.4,33.04 R9.2
N$19
  Top 0.152: R12.1 R13.1 | R12.1 IC6.3 | R12.1 35.58,31.32 C10.1
N$20
  Top 0.152: R17.1 35.58,42.96 35.98,43.36 LED1.A
N$21
  Top 0.152: X4.1 50.9,18.52 50.9,24.65 50.17,25.38 47.62,25.38 46.97,24.73 44.4,24.73 39.72,29.41 28.69,29.41 28.26,29.84 27.01,29.84 IC1.32
N$22
  Top 0.152: IC1.31 32.01,28.99 32.15,29.13 39.6,29.13 44.29,24.45 47.09,24.45 47.73,25.09 50.06,25.09 50.62,24.53 50.62,20.78 X4.2
N$23
  Top 0.152: IC1.30 31.6,28.19 32.27,28.85 39.49,28.85 44.21,24.13 X4.4
N$24
  Top 0.152: X3.LED+ 5.08,6.99 6.35,8.26 R6.2 5.35,13.42 R6.3
N$25
  Top 0.152: IC6.1 39.39,35 R14.1 R15.2 R16.1
N$26
  Top 0.152: R14.2 34.49,35 35.14,34.35 37.47,34.35 38.16,33.66 IC6.2
PWM_KOLBEN1  (via drill 0.3)
  Top 0.152: R21.1 R22.2 34.61,17.14 34.92,17.46 34.92,18.73 34.25,19.41 19.64,19.41 v19.05,20 | v18.41,31.11 18.45,31.08 IC1.9
  Bottom 0.152: v19.05,20 19.05,30.48 v18.41,31.11
PWM_KOLBEN2  (via drill 0.3)
  Top 0.152: R24.1 R25.2 20.95,17.14 21.59,17.78 21.59,18.41 20.95,19.05 20.88,19.13 18.65,19.13 17.46,20.32 17.14,20.32 v16.51,20.95 | v15.88,28.97 18.44,28.97 IC1.10
  Bottom 0.152: v16.51,20.95 15.88,21.59 v15.88,28.97
RESET  (via drill 0.3)
  Top 0.152: IC1.29 v28.57,27.39 29.78,27.39 R1.1
  Bottom 0.152: J2.5 11.43,45.72 15.24,45.72 17.14,43.81 17.14,38.82 v28.57,27.39
SCK  (via drill 0.3)
  Top 0.152: SJ2.3 6.1,23.11 6.35,22.86 | 6.35,22.86 11.43,22.86 12.06,23.5 IC3.5 16.51,23.5 17.27,22.74 IC1.17 | v6.35,22.23 6.35,22.86
  Bottom 0.152: v6.35,22.23 6.35,25.4 11.83,30.88 11.83,43.58 J2.3
TEMP_KOLBEN1  (via drill 0.3)
  Top 0.152: R7.2 v51.44,31.11
  Bottom 0.152: v51.44,31.11 51.44,13.97 45.09,7.62 29.84,7.62 26.67,4.45 J3.2
TEMP_KOLBEN2  (via drill 0.3)
  Top 0.152: v32.38,32.38 R12.2
  Bottom 0.152: J4.2 32.38,22.23 v32.38,32.38
TFT_CS  (via drill 0.3)
  Top 0.152: IC1.14 16.9,25.79 v16.51,25.4 | v16.51,22.86 16.51,22.23 15.88,21.59 12.06,21.59 11.43,20.95 IC3.14 7.62,20.95 6.67,20 6.6,19.94 SJ1.3
  Bottom 0.152: v16.51,25.4 v16.51,22.86
TFT_CS3V3
  Top 0.152: SJ1.1 6.1,18.16 7.62,19.68 IC3.15
TFT_DC
  Top 0.152: SJ4.3 9.27,29.46 12.7,26.04 IC3.7 16.51,26.04 17.06,26.59 IC1.13
TFT_DC3V3
  Top 0.152: SJ4.1 6.6,27.69 7.62,26.67 11.43,26.67 13.34,24.77 IC3.6
TFT_MOSI3V3
  Top 0.152: SJ3.1 5.97,24.51 6.99,23.5 IC3.12
TFT_RESET
  Top 0.152: IC1.12 16.43,27.39 15.88,27.94 11.19,27.94 9.14,29.98 4.36,29.98 4.22,29.84 X3.RESET
TFT_SCK3V3
  Top 0.152: SJ2.1 6.1,21.34 6.35,21.59 11.43,21.59 12.06,22.23 IC3.4
V_BAT
  Top 0.152: R5.2 R4.1 31.75,25 | IC1.26 30.48,24.99 31.73,24.99 31.75,25 | C3.2 31.75,25
V_IN
  Top 0.152: R4.2 31.75,27.94 32.38,28.57 39.37,28.57 40.22,27.73 C4.2 | C14.2 34.47,12.58 D3.C 34.47,9.45 R19.2 33.67,7 33.66,6.99 | C13.2 21.14,12.73 D2.C 21.14,9.37 R18.2 20.34,7.29 20.64,6.99
  Top 0.305: C4.2 40.22,13.14 IC4.1 40.24,13.03 40.24,11.19 41.91,9.53 41.91,6.99 J1.1
  Top 1.016: 34.92,3.17 34.92,5.71 33.66,6.99 31.11,6.99 | J1.1 34.92,3.17 | 34.92,3.17 34.61,3.17 32.38,0.95 23.5,0.95 21.27,3.17 21.27,5.08 21.27,6.35 20.64,6.99 17.46,6.99
  pour Top: 17.78,6.35 17.78,10.32 15.4,10.32 15.4,6.35
  pour Top: 31.11,6.35 31.11,10.32 28.73,10.32 28.73,6.35
VCC  (via drill 0.3)
  Top 0.152: R6.1 7.35,16.72 v7.62,16.99 | v19.68,45.09 19.05,44.45 19.05,43.83 | 19.05,43.83 C1.1 | 19.05,36.81 R2.2 R3.2 22.24,36.83 22.86,36.83 23.2,36.49 C16.2 23.1,33.24 IC1.4 | 19.05,36.81 C6.1 18.04,36.88 D1.C 15.21,36.91 13.73,36.91 13.41,37.23 12.25,37.23 IC5.3 9.45,40.01 5.71,40.01 X3.VCC | 19.07,41.91 19.07,36.83 19.05,36.81 | J2.2 19.07,41.91 | v40.64,29.84 41.91,31.11 41.91,31.75 41.91,34.21 42.62,34.92 IC6.8 44.67,38.69 C11.1 | R8.2 v51.44,32.38 | v30.8,25.48 30.39,25.48 R1.2 | v32.38,33.66 R13.2 | 19.07,41.91 19.07,43.81 19.05,43.83 | 20.74,21 C15.1 20.69,20.38 20.2,19.88 v19.81,19.88
  Top 0.305: IC1.4 23.1,26.91 20.7,24.51 IC1.18 20.7,21.04 20.74,21 | IC4.2 38.42,10.38 38.42,11.99 37.06,13.35 37.06,15.88 38.42,17.24 C5.1 v29.84,20.91 22.3,20.91 20.83,20.91 20.74,21 | 20.74,21 C15.1
  Bottom 0.152: v29.84,20.91 30.8,21.86 v30.8,25.48 30.8,32.7 31.75,33.66 v32.38,33.66 38.73,27.3 39.34,27.3 40.49,28.45 40.49,29.7 v40.64,29.84 43.18,32.38 v51.44,32.38 | IC2.8 v19.68,45.09 | v19.81,19.88 19.81,18.54 18.26,16.99 v7.62,16.99
VDD  (via drill 0.3)
  Top 0.152: C2.2 14.19,18.27 IC3.1 v12.06,18.41 | v12.06,28.57 12.25,28.76 C8.1 13.97,31.57 13.97,34.29 13.97,34.88 | IC5.2 12.38,34.92 12.43,34.88 13.97,34.88 | D1.A 13.97,34.88
  Bottom 0.152: v12.06,28.57 v12.06,18.41

### Text on the board
tNames: 5V | 3.3V | 5V | 3.3V | 5V | 3.3V | 5V | 3.3V
bNames: https://github.com/tr4nt0r/Loetstation
200bmp: G:/Meine Ablage/EAGLE/404px-sam_and_max_sth.bmp